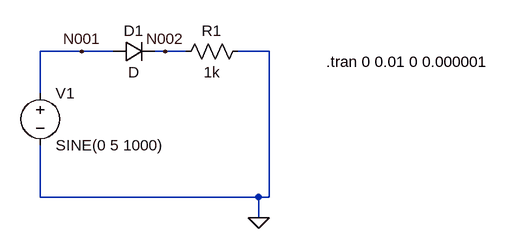
[diagram p0: schematic DR_series.asc]
DR_series.asc, the LTspice schematic file:
Version 4
SHEET 1 880 680
WIRE 48 112 -16 112
WIRE 96 112 48 112
WIRE 176 112 160 112
WIRE 208 112 176 112
WIRE 336 112 288 112
WIRE -16 176 -16 112
WIRE -16 336 -16 256
WIRE 320 336 -16 336
WIRE 336 336 336 112
WIRE 336 336 320 336
WIRE 320 368 320 336
FLAG 320 368 0
FLAG 48 112 N001
FLAG 176 112 N002
SYMBOL voltage -16 160 R0
WINDOW 123 0 0 Left 0
WINDOW 39 0 0 Left 0
SYMATTR InstName V1
SYMATTR Value SINE(0 5 1000)
SYMBOL diode 96 128 R270
WINDOW 0 32 32 VTop 2
WINDOW 3 0 32 VBottom 2
SYMATTR InstName D1
SYMBOL res 304 96 R90
WINDOW 0 0 56 VBottom 2
WINDOW 3 32 56 VTop 2
SYMATTR InstName R1
SYMATTR Value 1k
TEXT 424 128 Left 2 !.tran 0 0.01 0 0.000001

The netlist it stands for:
* DR_series.asc
V1 N001 0 SINE(0 5 1000)
D1 N001 N002 D
R1 0 N002 1k
.model D D
.lib standard.dio
.tran 0 0.01 0 0.000001
.backanno
.end